# EAGLE design Shield Telemetria2 (EAGLE 7.6.0)
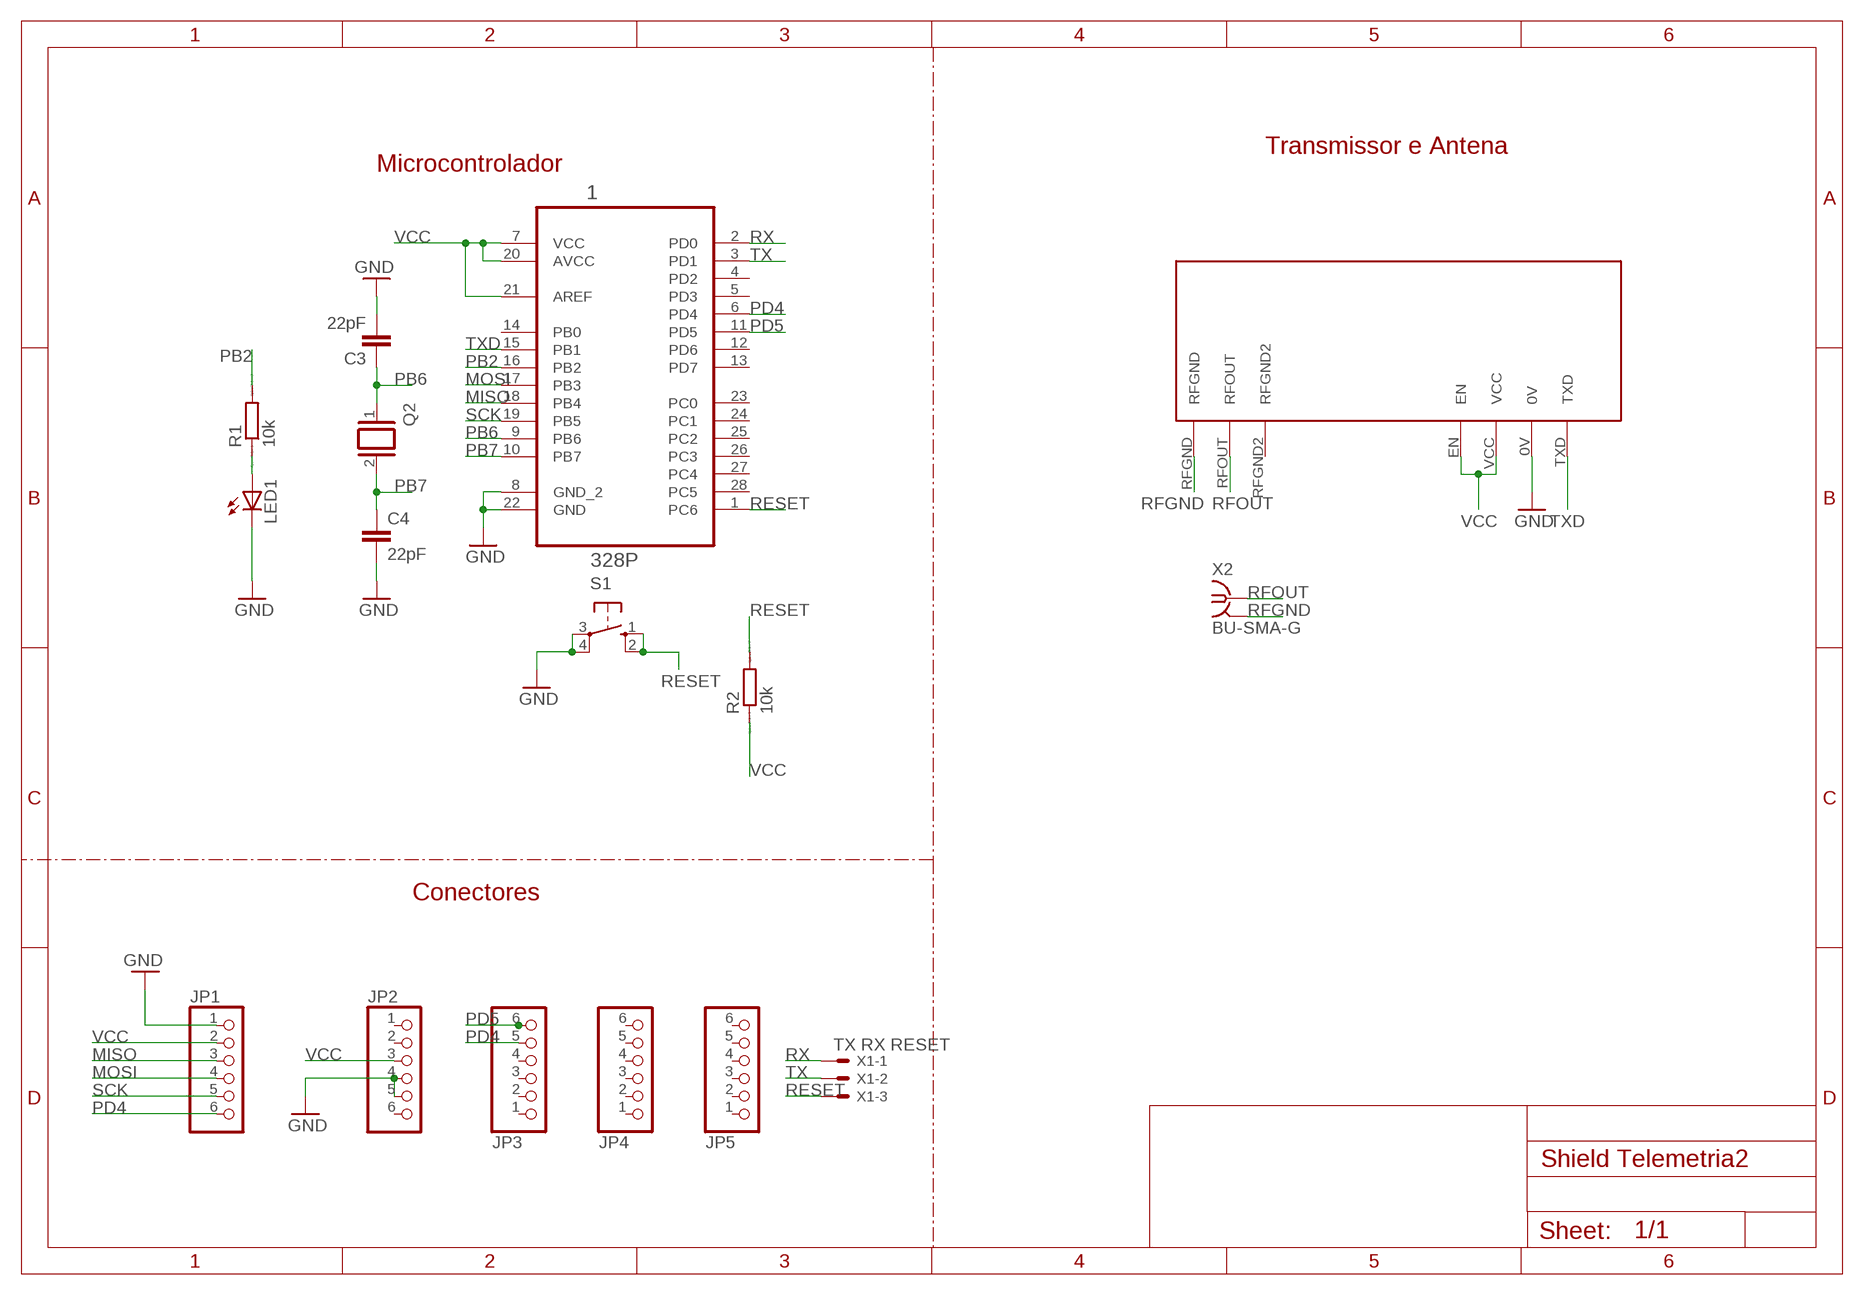
[diagram p0: schematic, sheet 1]

## Parts
1  328P  ATMEGA328P-PU  [DIP254P762X457-28]
C3  22pF  C5/4.5  [C5B4.5]
C4  22pF  C5/4.5  [C5B4.5]
JP1  PINHD-1X6  [1X06]
JP2  PINHD-1X6  [1X06]
JP3  PINHD-1X6  [1X06]
JP4  PINHD-1X6  [1X06]
JP5  PINHD-1X6  [1X06]
LED1  LED3MM  [LED3MM]
Q2  XTAL/S  [QS]
R1  10k  R0207/10  [0207/10]
R2  10k  R0207/10  [0207/10]
S1  10-XX  [B3F-10XX]
U$1  NTX2  [NTX2]
X1  TX RX RESET  22-23-2031  [22-23-2031]
X2  BU-SMA-G  [BU-SMA-G]

## Nets
GND: 1.8(GND_2) 1.22(GND) C3.2 C4.2 JP1.1 JP2.4 JP2.5 LED1.K(C) S1.3(P) S1.4(P1) U$1.0V
MISO: 1.18(PB4) JP1.3
MOSI: 1.17(PB3) JP1.4
N$6: LED1.A R1.1
PB2: 1.16(PB2) R1.2
PB6: 1.9(PB6) C3.1 Q2.1
PB7: 1.10(PB7) C4.1 Q2.2
PD4: 1.6(PD4) JP1.6 JP3.5
PD5: 1.11(PD5) JP3.6
RESET: 1.1(PC6) R2.2 S1.1(S) S1.2(S1) X1.3
RFGND: U$1.RFGND X2.2 X2.3 X2.4 X2.5
RFOUT: U$1.RFOUT X2.1
RX: 1.2(PD0) X1.1
SCK: 1.19(PB5) JP1.5
TX: 1.3(PD1) X1.2
TXD: 1.15(PB1) U$1.TXD
VCC: 1.7(VCC) 1.20(AVCC) 1.21(AREF) JP1.2 JP2.3 R2.1 U$1.EN U$1.VCC
Unconnected: 1.4(PD2) 1.5(PD3) 1.12(PD6) 1.13(PD7) 1.14(PB0) 1.23(PC0) 1.24(PC1) 1.25(PC2) 1.26(PC3) 1.27(PC4) 1.28(PC5) JP2.1 JP2.2 JP2.6 JP3.1 JP3.2 JP3.3 JP3.4 JP4.1 JP4.2 JP4.3 JP4.4 JP4.5 JP4.6 JP5.1 JP5.2 JP5.3 JP5.4 JP5.5 JP5.6 U$1.RFGND2

## Notes on the sheet
- Transmissor e Antena
- Microcontrolador
- Conectores

## Library data of the parts
1 = Atmel_By_element14_Batch_1-00:ATMEGA328P-PU: 8-bit Microcontroller with In-System Programmable Flash; MPN: ATMEGA328P-PU; OC_FARNELL: 1715487; OC_NEWARK: 15R0268; PACKAGE: PDIP-28; SUPPLIER: Atmel
C3 C4 = capacitor-wima:C: CAPACITOR naming: grid - package width
JP1 = adafruit:PINHD-1X6: PIN HEADER
JP2-JP5 = pinhead:PINHD-1X6: PIN HEADER
LED1 = adafruit:LED: LED OSRAM: - CHIPLED LG R971, LG N971, LY N971, LG Q971, LY Q971, LO R971, LY R971 LH N974, LH R974 LS Q976, LO Q976, LY Q976 LO Q996 - Hyper CHIPLED LW Q18S LB Q993, LB Q99A, LB R99A - SideLED LS A670, LO A670, LY A670, LG A670, LP A670 LB A673, LV A673, LT A673, LW A673 LH A674 LY A675 LS A676, LA A676, LO A676, LY A676, LW A676 LS A679, LY A679, LG A679 - Hyper Micro SIDELED® LS Y876, LA Y876, LO Y876, LY Y876 LT Y87S - SmartLED LW L88C, LW L88S LB L89C, LB L89S, LG L890 LS L89K, LO L89K, LY L89K LS L896, LA L896, LO L896, LY L896 - TOPLED LS T670, LO T670, LY T670, LG T670, LP T670 LSG T670, LSP T670, LSY T670, LOP T670, LYG T670 LG T671, LOG T671, LSG T671 LB T673, LV T673, LT T673, LW T673 LH T674 LS T676, LA T676, LO T676, LY T676, LB T676, LH T676, LSB T676, LW T676 LB T67C, LV T67C, LT T67C, LS T67K, LO T67K, LY T67K, LW E67C LS E67B, LA E67B, LO E67B, LY E67B, LB E67C, LV E67C, LT E67C LW T67C LS T679, LY T679, LG T679 LS T770, LO T770, LY T770, LG T770, LP T770 LB T773, LV T773, LT T773, LW T773 LH T774 LS E675, LA E675, LY E675, LS T675 LS T776, LA T776, LO T776, LY T776, LB T776 LHGB T686 LT T68C, LB T68C - Hyper Mini TOPLED® LB M676 - Mini TOPLED Santana® LG M470 LS M47K, LO M47K, LY M47K Source: http://www.osram.convergy.de/
Q2 = special:XTAL/S: CRYSTAL
R1 R2 = eagle-ltspice:R: RESISTOR, European symbol; SPICEMODEL: NONE; SPICEPREFIX: R
S1 = switch-omron:10-XX: OMRON SWITCH; MPN: B3F-1000; OC_FARNELL: 176432; OC_NEWARK: 36M3542
U$1 = Ava:NTX2: Radiometrix NTX2 Transmitter Module Author Anthony Stirk / http://ava.upuaut.net
X1 = con-molex:22-23-2031: .100" (2.54mm) Center Header - 3 Pin; MF: MOLEX; MPN: 22-23-2031; OC_FARNELL: 1462950; OC_NEWARK: 30C0862
X2 = con-coax:BU-SMA-G: FEMALE SMA CONNECTOR Radiall distributor RS 193-9117; OC_FARNELL: unknown; OC_NEWARK: unknown

## Board
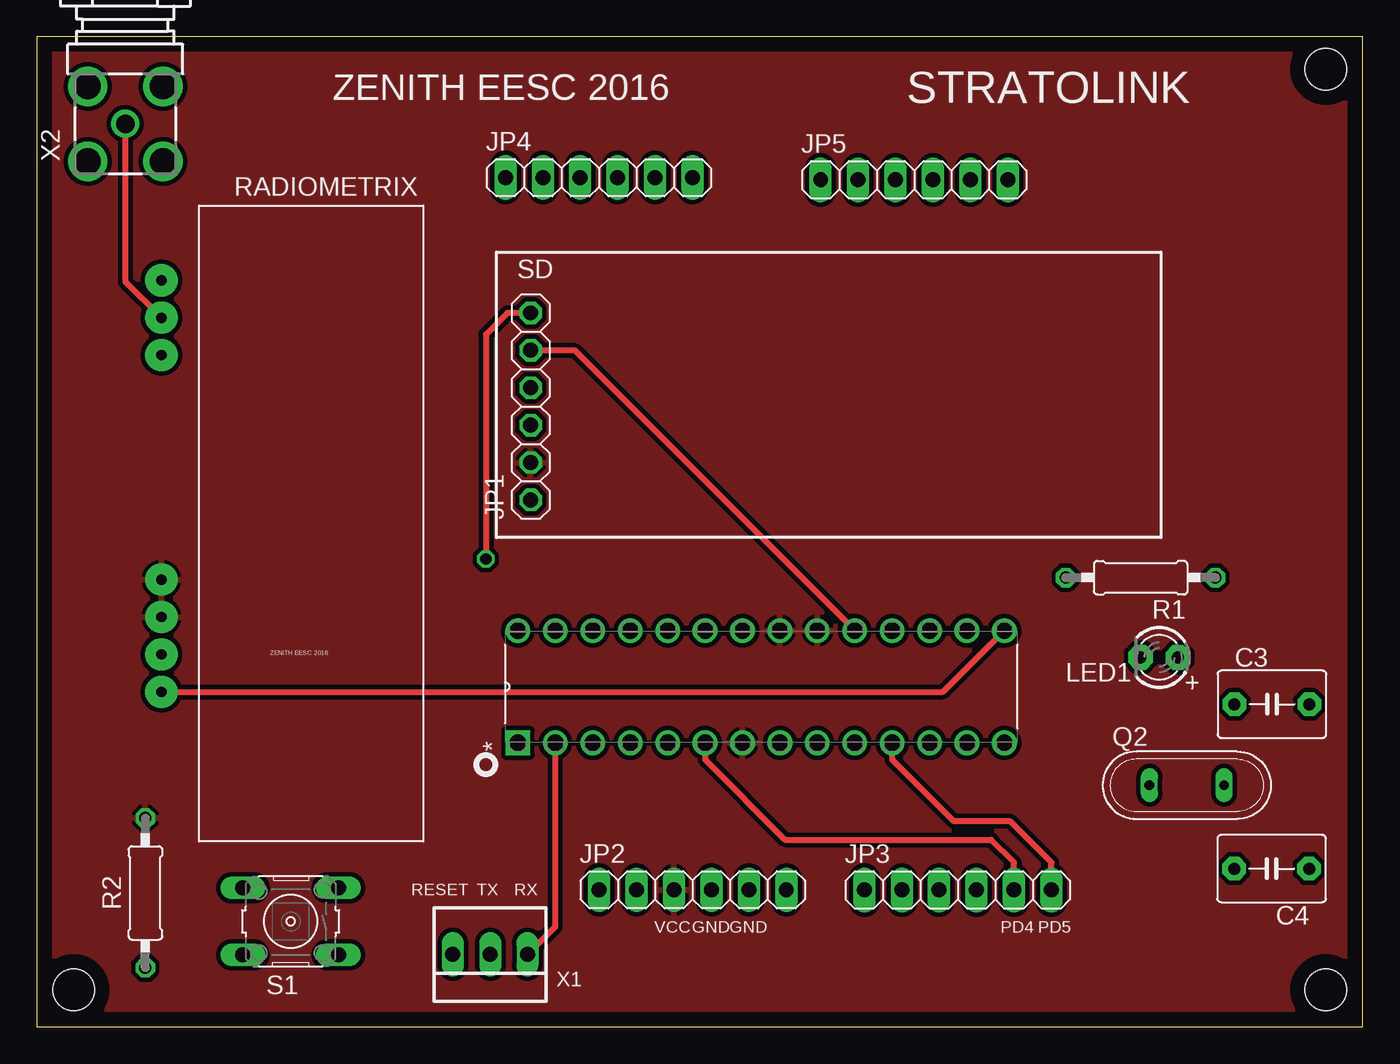
[diagram p1: board, top side]
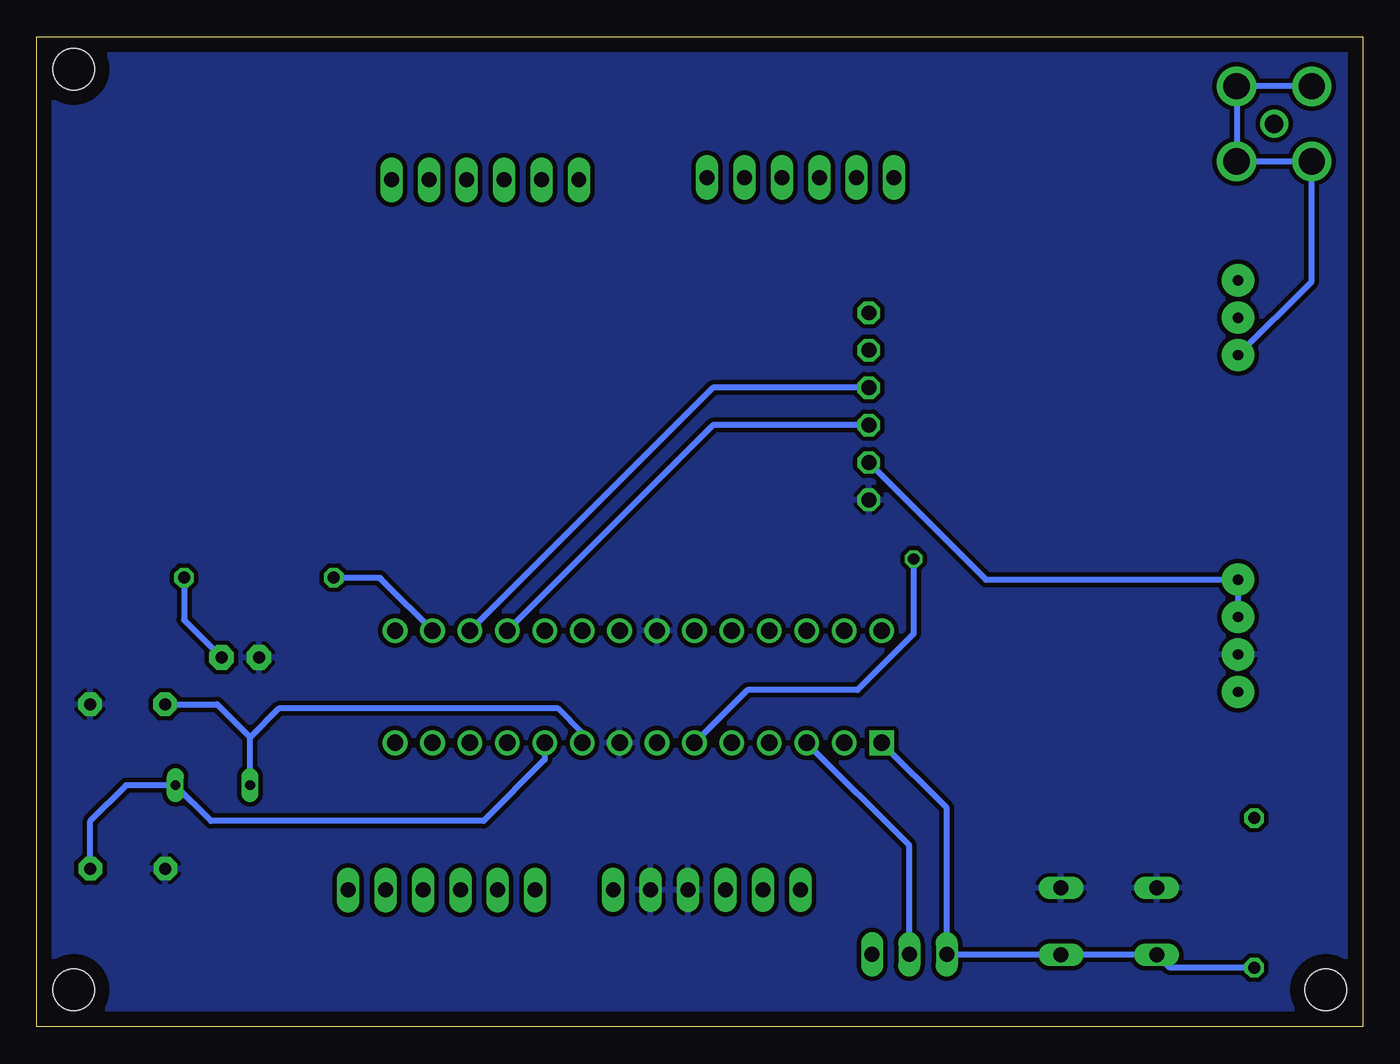
[diagram p2: board, bottom side, seen from below]

Size 90 x 67.2 mm. Coordinates in mm from the lower left corner, seen from the top.
Outline: 0,0 90,0 90,67.2 0,67.2 0,0
Copper layers (1*16): Top 0.035mm / dielectric 1.5mm / Bottom 0.035mm
Design rules "default *": minimum track width 10mil, minimum drill 26mil, track to track 12mil, track to pad 12mil, pad to pad 12mil, via to via 12mil, smd to smd 12mil, copper to edge 40mil, drill to drill 8mil, minimum pad ring 10mil, minimum via ring 8mil, stop-mask expansion 4mil, vias tented up to drill 0mil, thermal gap 10mil
Holes 2.8 mm at 2.5,2.5 87.5,2.5 87.5,65

### Footprints (pad centres in the part's own frame; a part is rotated, then mirrored left to right if it is on the bottom)
DIP254P762X457-28 = drill 1.118 square: 1 -7.62,33.02 | drill 1.118: 2 -7.62,30.48; 3 -7.62,27.94; 4 -7.62,25.4; 5 -7.62,22.86; 6 -7.62,20.32; 7 -7.62,17.78; 8 -7.62,15.24; 9 -7.62,12.7; 10 -7.62,10.16; 11 -7.62,7.62; 12 -7.62,5.08; 13 -7.62,2.54; 14 -7.62,0; 15 0,0; 16 0,2.54; 17 0,5.08; 18 0,7.62; 19 0,10.16; 20 0,12.7; 21 0,15.24; 22 0,17.78; 23 0,20.32; 24 0,22.86; 25 0,25.4; 26 0,27.94; 27 0,30.48; 28 0,33.02
C5B4.5 = drill 0.813 pad 1.6 octagon: 1 -2.54,0; 2 2.54,0
1X06 = drill 1.016 octagon: 1 -6.35,0; 2 -3.81,0; 3 -1.27,0; 4 1.27,0; 5 3.81,0; 6 6.35,0
1X06' = drill 1.016 long: 1 -6.35,0; 2 -3.81,0; 3 -1.27,0; 4 1.27,0; 5 3.81,0; 6 6.35,0
LED3MM = drill 0.813 pad 1.676 octagon: A -1.27,0; K 1.27,0
QS = drill 0.66 long: 1 -2.54,0; 2 2.54,0
0207/10 = drill 0.813 octagon: 1 -5.08,0; 2 5.08,0
B3F-10XX = drill 1.016 long: 1 -3.251,2.261; 2 3.251,2.261; 3 -3.251,-2.261; 4 3.251,-2.261
NTX2 = drill 0.7 pad 2.184: 0V -2.54,-10.16; EN -7.62,-10.16; RFGND -22.86,-10.16; RFGND2 -27.94,-10.16; RFOUT -25.4,-10.16; TXD 0,-10.16; VCC -5.08,-10.16
22-23-2031 = drill 1 long: 1 -2.54,0; 2 0,0; 3 2.54,0
BU-SMA-G = drill 1.27: 1 0,0 | drill 1.778: 2 -2.55,2.55; 3 2.55,2.55; 4 2.55,-2.55; 5 -2.55,-2.55

### Placement (x,y rotation side)
1  65.68,26.89 90 top
C3  83.84,21.89 0 top
C4  83.82,10.73 180 top
JP1  33.53,42.11 90 top
JP2  [1X06']  44.52,9.29 0 top
JP3  [1X06']  62.52,9.28 0 top
JP4  [1X06']  38.16,57.64 0 top
JP5  [1X06']  59.56,57.49 0 top
LED1  76.19,25.07 180 top
Q2  78.06,16.39 0 top
R1  74.93,30.48 180 top
R2  7.37,9.08 270 top
S1  17.23,7.15 180 top
U$1  18.62,22.73 270 top
X1  30.77,4.91 180 top
X2  6.01,61.29 90 top

### Tracks (layer width: path | path; a pad name or v marks a point on that pad's centre or on a via)
GND
  pour Bottom: 0,0 90.17,0 90.17,67.31 0,67.31
MISO
  Bottom 0.406: JP1.3 44.11,40.84 1.18
MOSI
  Bottom 0.406: JP1.4 44.11,43.38 1.17
N$6
  Bottom 0.406: R1.1 80.01,27.62 LED1.A
PB2
  Bottom 0.406: 1.16 66.39,30.14 66.58,30.33 66.73,30.48 R1.2
PB6
  Bottom 0.406: C3.1 77.77,21.89 75.52,19.64 | Q2.1 75.52,19.64 | 1.9 52.98,19.96 54.61,21.59 73.57,21.59 75.52,19.64
PB7
  Bottom 0.406: C4.1 86.36,13.97 83.94,16.39 Q2.2 78.18,13.97 59.69,13.97 55.52,18.14 1.10
PD4  (via drill 0.76)
  Top 0.406: 1.6 45.36,18.14 50.8,12.7 64.77,12.7 66.33,11.14 JP3.5 | JP1.6 31.95,48.46 30.48,46.99 v30.48,31.75
  Bottom 0.406: v30.48,31.75 30.48,26.67 34.29,22.86 41.77,22.86 1.6
PD5
  Top 0.406: JP3.6 68.87,11.14 66.04,13.97 62.23,13.97 58.06,18.14 1.11
RESET
  Bottom 0.406: R2.2 13.09,4 S1.2 S1.1 28.21,4.89 X1.3 28.23,14.84 1.1
RFGND
  Bottom 0.406: X2.3 X2.4 X2.5 X2.2 3.46,50.59 U$1.RFGND
RFOUT
  Top 0.406: X2.1 6.01,50.58 U$1.RFOUT
RX
  Top 0.406: X1.1 35.2,6.8 1.2
SCK
  Top 0.406: JP1.5 36.49,45.92 1.19
TX
  Bottom 0.406: X1.2 30.77,12.3 1.3
TXD
  Top 0.406: U$1.TXD 61.52,22.73 1.15
VCC
  Bottom 0.406: JP1.2 25.58,30.35 U$1.EN U$1.VCC
  pour Top: 0,0 90.17,0 90.17,67.31 0,67.31

### Text on the board
tPlace: RESET | TX | RX | VCC | GND | GND | PD4 | PD5
tNames: ZENITH EESC 2016 | STRATOLINK | RADIOMETRIX | SD | ZENITH EESC 2016